# Altium schematic sheet Power.SchDoc
size A; SheetNumber: 5; SheetTotal: 6
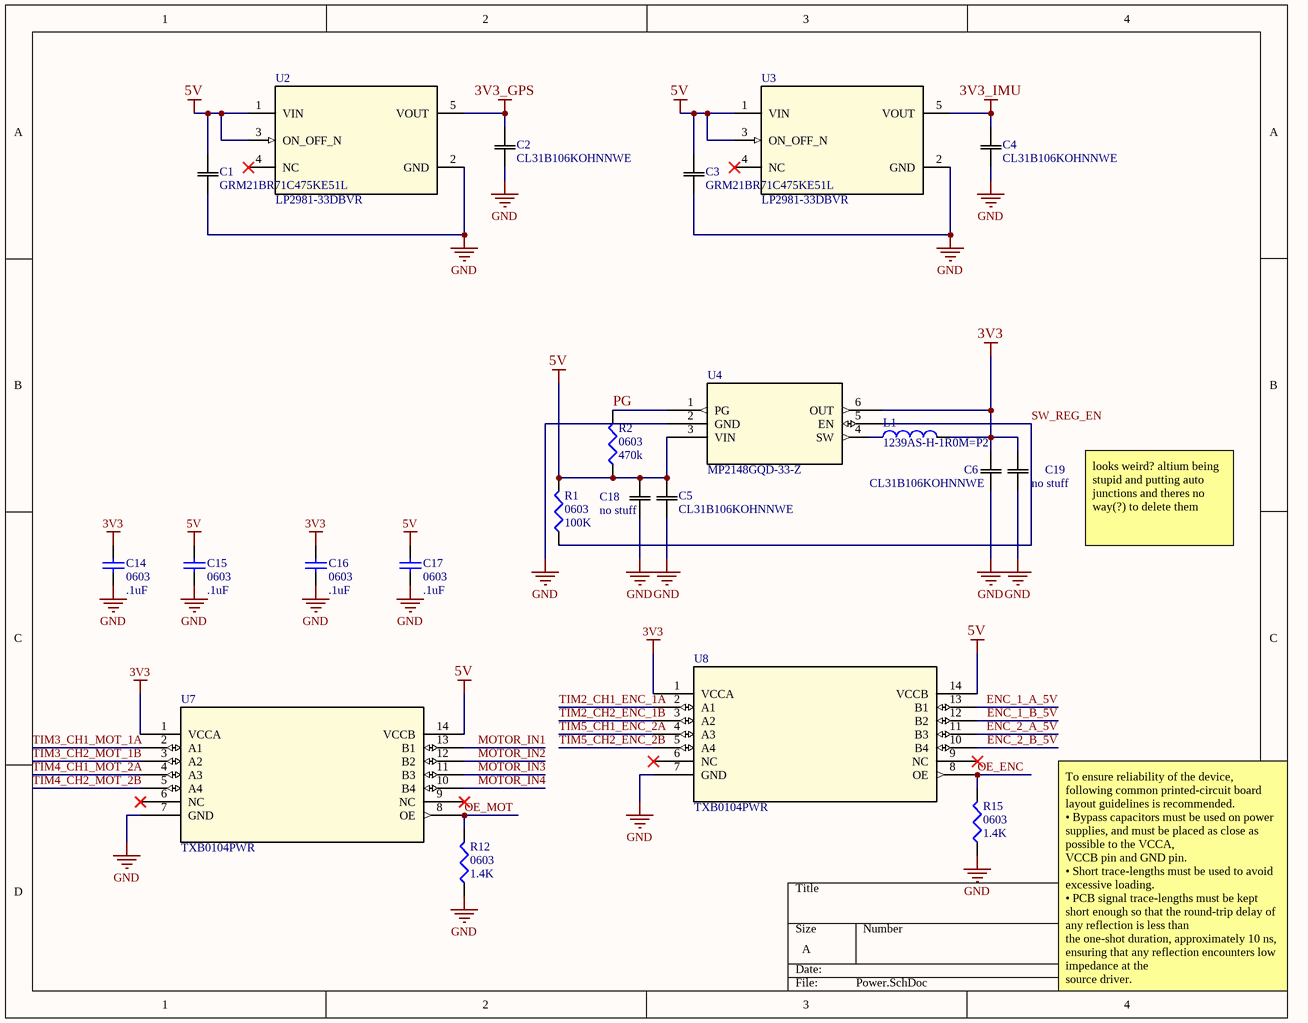
[diagram p0: Power.SchDoc]

## Parts
C1  GRM21BR71C475KE51L  [CAP_GRM0805_2X1P25_MUR]
C2  CL31B106KOHNNWE  [CAP_CL31_SAM]
C3  GRM21BR71C475KE51L  [CAP_GRM0805_2X1P25_MUR]
C4  CL31B106KOHNNWE  [CAP_CL31_SAM]
C5  CL31B106KOHNNWE  [CAP_CL31_SAM]
C6  CL31B106KOHNNWE  [CAP_CL31_SAM]
C14  0603  value .1uF  [1608[0603]]
C15  0603  value .1uF  [1608[0603]]
C16  0603  value .1uF  [1608[0603]]
C17  0603  value .1uF  [1608[0603]]
C18  no stuff  [CAP_CL31_SAM]
C19  no stuff  [CAP_CL31_SAM]
L1  1239AS-H-1R0M=P2  [CAPC10555_55N_KEM]
R1  0603  value 100K  [J1-0603]
R2  0603  value 470k  [J1-0603]
R12  0603  value 1.4K  [J1-0603]
R15  0603  value 1.4K  [J1-0603]
U2  LP2981-33DBVR  [DBV0005A_N]
U3  LP2981-33DBVR  [DBV0005A_N]
U4  MP2148GQD-33-Z  [QFN-1p0x1p5_MNP]
U7  TXB0104PWR  [PW14]
U8  TXB0104PWR  [PW14]

## Nets
3V3: C6.2 C14.2 C16.2 C19.2 L1.2 U4.6(OUT) U7.1(VCCA) U8.1(VCCA)
3V3_GPS: C2.2 U2.5(VOUT)
3V3_IMU: C4.2 U3.5(VOUT)
5V: C1.2 C3.2 C5.2 C15.2 C17.2 C18.2 R1.2 R2.1 U2.1(VIN) U2.3(ON_OFF_N) U3.1(VIN) U3.3(ON_OFF_N) U4.3(VIN) U7.14(VCCB) U8.14(VCCB)
GND: C1.1 C2.1 C3.1 C4.1 C5.1 C6.1 C14.1 C15.1 C16.1 C17.1 C18.1 C19.1 R12.1 R15.1 U2.2(GND) U3.2(GND) U4.2(GND) U7.7(GND) U8.7(GND)
ENC_1_A_5V: U8.13(B1)
ENC_1_B_5V: U8.12(B2)
ENC_2_A_5V: U8.11(B3)
ENC_2_B_5V: U8.10(B4)
MOTOR_IN1: U7.13(B1)
MOTOR_IN2: U7.12(B2)
MOTOR_IN3: U7.11(B3)
MOTOR_IN4: U7.10(B4)
OE_ENC: R15.2 U8.8(OE)
OE_MOT: R12.2 U7.8(OE)
PG: R2.2 U4.1(PG)
SW_REG_EN: R1.1 U4.5(EN)
TIM2_CH1_ENC_1A: U8.2(A1)
TIM2_CH2_ENC_1B: U8.3(A2)
TIM3_CH1_MOT_1A: U7.2(A1)
TIM3_CH2_MOT_1B: U7.3(A2)
TIM4_CH1_MOT_2A: U7.4(A3)
TIM4_CH2_MOT_2B: U7.5(A4)
TIM5_CH1_ENC_2A: U8.4(A3)
TIM5_CH2_ENC_2B: U8.5(A4)
NetL1_1: L1.1 U4.4(SW)

Not connected (* = marked no-connect by the designer): U2 4(NC)*; U3 4(NC)*; U7 6(NC)* 9(NC)*; U8 6(NC)* 9(NC)*

## Notes on the sheet
- looks weird? altium being stupid and putting auto junctions and theres no way(?) to delete them
- To ensure reliability of the device, following common printed-circuit board layout guidelines is recommended.
  • Bypass capacitors must be used on power supplies, and must be placed as close as possible to the VCCA,
  VCCB pin and GND pin.
  • Short trace-lengths must be used to avoid excessive loading.
  • PCB signal trace-lengths must be kept short enough so that the round-trip delay of any reflection is less than
  the one-shot duration, approximately 10 ns, ensuring that any reflection encounters low impedance at the
  source driver.

## Library data of the parts
C1 C3 = GRM21BR71C475KE51L: No Description Available; Mfr_Name: Murata; Type: DEV; Copyright: Copyright (C) 2023 Ultra Librarian. All rights reserved.; Manufacturer_Part_Number: GRM21BR71C475KE51L; Digi-Key_Part_Number_1: 490-14466-2-ND; Digi-Key_Part_Number_2: 490-14466-1-ND; Digi-Key_Part_Number_3: 490-14466-6-ND; RefDes: RefDes
C2 C4-C6 C18 C19 = CL31B106KOHNNWE: No Description Available; Mfr_Name: Samsung; Type: DEV; Copyright: Copyright (C) 2023 Ultra Librarian. All rights reserved.; Manufacturer_Part_Number: CL31B106KOHNNWE; Digi-Key_Part_Number_1: 1276-3105-2-ND; Digi-Key_Part_Number_2: 1276-3105-1-ND; Digi-Key_Part_Number_3: 1276-3105-6-ND; RefDes: RefDes
C14-C17 = Cap Semi: Capacitor (Semiconductor SIM Model); Published: 8-Jun-2000; LatestRevisionDate: 29-May-2009; LatestRevisionNote: IPC-7351 Footprint Added.; PackageReference: C1206; Publisher: Altium Limited; PackageDescription: Chip Capacitor
L1 = 1239AS-H-1R0M=P2: Inductor with Inductance: 1uH Tol. +/-20%, Package: 1008 _2520_; MF: Murata Electronics; SnapEDA_Link: https://www.snapeda.com/parts/1239AS-H-1R0M%3DP2/Murata%20Electronics%20North%20America/view-part/581165/?ref=snap; Digi-Key_Part_Number: 490-10564-1-ND; Value: *; Digi-Key_Purchase_URL: https://www.digikey.com.au/product-detail/en/murata-electronics/1239AS-H-1R0M=P2/490-10564-1-ND/5272022?utm_source=snapeda&utm_medium=aggregator&utm_campaign=symbol; MP: 1239AS-H-1R0M=P2; Package: 2520 Murata
R1 R2 R12 R15 = Res3: Resistor; Published: 8-Jun-2000; LatestRevisionDate: 29-May-2009; LatestRevisionNote: IPC-7351 Footprint Added.; PackageReference: J1-0603; Publisher: Altium Limited; PackageDescription: Chip Resistor
U2 U3 = LP2981-33DBVR: No Description Available; Mfr_Name: Texas Instruments; Type: DEV; RefDes: RefDes; Copyright: Copyright (C) 2023 Ultra Librarian. All rights reserved.; Manufacturer_Part_Number: LP2981-33DBVR; Digi-Key_Part_Number_1: 296-17360-1-ND; Digi-Key_Part_Number_2: 296-17360-2-ND; Digi-Key_Part_Number_3: 296-17360-6-ND; Digi-Key_Part_Number_4: 2156-LP2981-33DBVR-ND
U4 = MP2148GQD-33-Z: No Description Available; Mfr_Name: Monolithic Power Systems; Copyright: Copyright (C) 2023 Ultra Librarian. All rights reserved.; Manufacturer_Part_Number: MP2148GQD-33-Z; Digi-Key_Part_Number_1: MP2148GQD-33-Z-ND; RefDes: RefDes; Type: DEV
U7 U8 = TXB0104PWR: No Description Available; Mfr_Name: Texas Instruments; Copyright: Copyright (C) 2023 Ultra Librarian. All rights reserved.; Manufacturer_Part_Number: TXB0104PWR; Digi-Key_Part_Number_1: 296-21929-1-ND; Digi-Key_Part_Number_2: 296-21929-2-ND; Digi-Key_Part_Number_3: 296-21929-6-ND; RefDes: RefDes; Type: DEV